# Altium schematic sheet STM32.SchDoc
size A4; DocumentNumber: 5; SheetNumber: 5; SheetTotal: 7
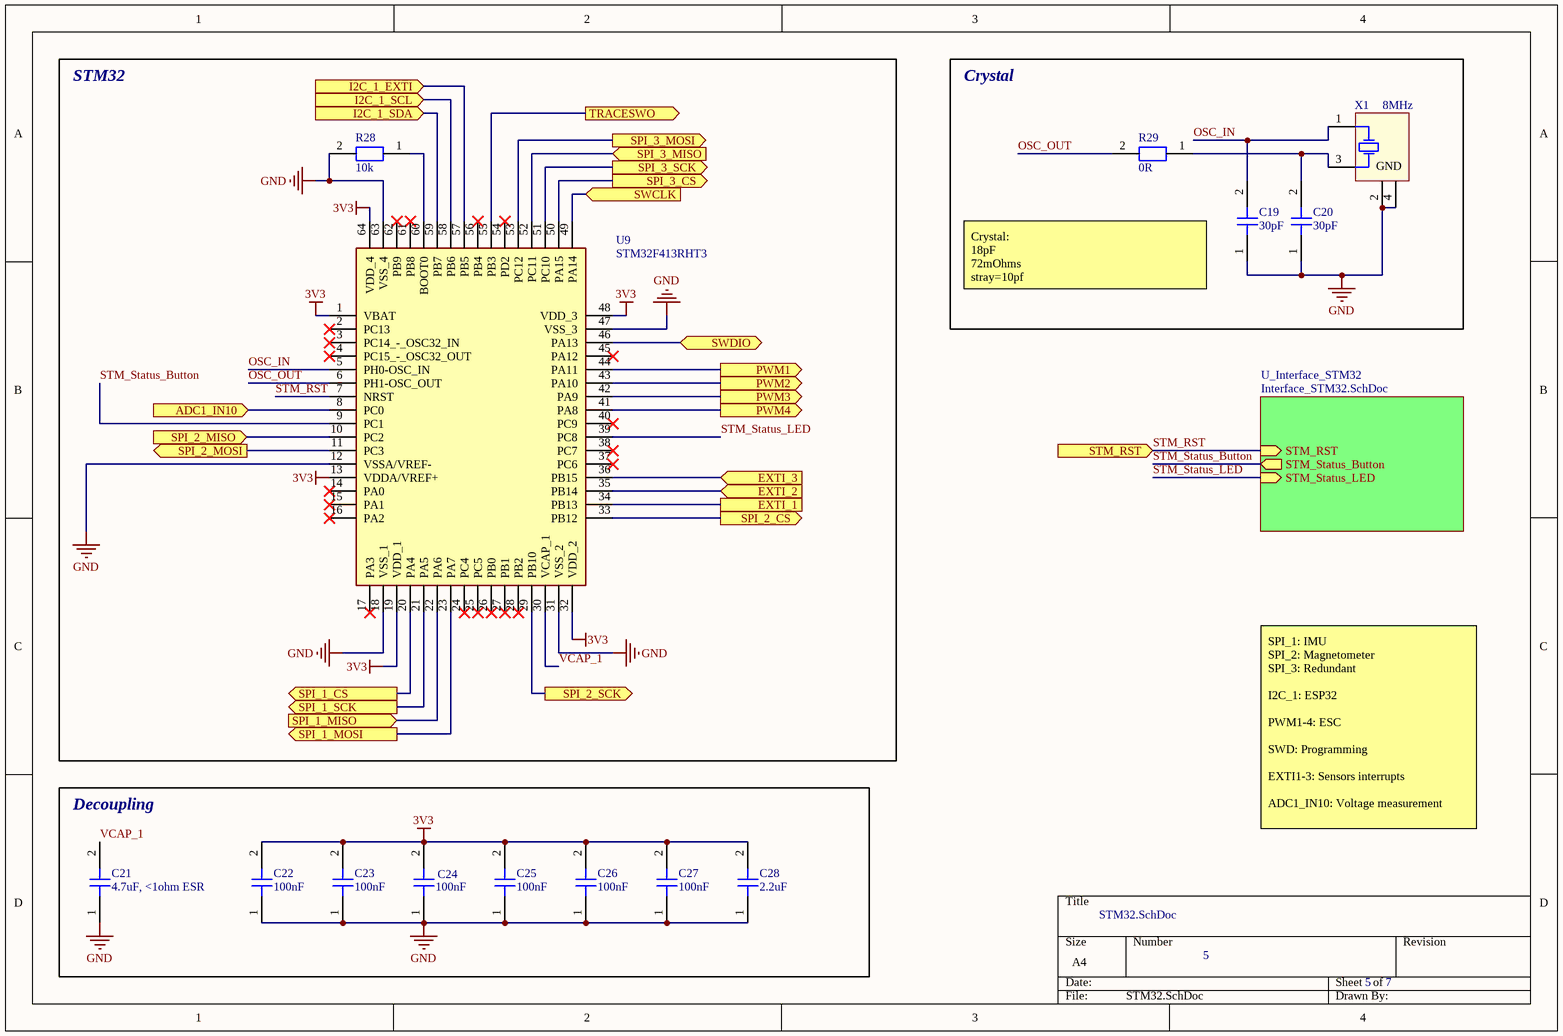
[diagram p0: STM32.SchDoc]

## Parts
C19  30pF  [Cap_0603_Medium_Density]
C20  30pF  [Cap_0603_Medium_Density]
C21  4.7uF, <1ohm ESR  [Cap_0603_Medium_Density]
C22  100nF  [Cap_0603_Medium_Density]
C23  100nF  [Cap_0603_Medium_Density]
C24  100nF  [Cap_0603_Medium_Density]
C25  100nF  [Cap_0603_Medium_Density]
C26  100nF  [Cap_0603_Medium_Density]
C27  100nF  [Cap_0603_Medium_Density]
C28  2.2uF  [Cap_0603_Medium_Density]
R28  10k  [Res_0603_Medium_Density]
R29  0R  [Res_0603_Medium_Density]
U9  STM32F413RHT3  [QFP50P1200X1200X160-64N]
X1  8MHz  [ABRA-ABMM2-4_V]

## Blocks framed on the sheet
STM32: R28 U9
Crystal: C19 C20 R29 X1
Decoupling: C21-C28

## Sub-sheets
U_Interface_STM32 = Interface_STM32.SchDoc: STM_Status_Button (out), STM_Status_LED (in), STM_RST (in)

## Ports
ADC1_IN10 (in), EXTI_1, EXTI_2 (in), EXTI_3 (in), I2C_1_EXTI (in), I2C_1_SCL (in), I2C_1_SDA (in), PWM1 (out), PWM2 (out), PWM3 (out), PWM4 (out), SPI_1_CS (out), SPI_1_MISO (in), SPI_1_MOSI (out), SPI_1_SCK (out), SPI_2_CS (out), SPI_2_MISO (in), SPI_2_MOSI (out), SPI_2_SCK (out), SPI_3_CS (out), SPI_3_MISO (in), SPI_3_MOSI (out), SPI_3_SCK (out), STM_RST (in), SWCLK (in), SWDIO (bidir), TRACESWO (out)

## Nets
3V3: C22.2 C23.2 C24.2 C25.2 C26.2 C27.2 C28.2 U9.1(VBAT) U9.13(VDDA/VREF+) U9.19(VDD_1) U9.32(VDD_2) U9.48(VDD_3) U9.64(VDD_4)
GND: C19.1 C20.1 C21.1 C22.1 C23.1 C24.1 C25.1 C26.1 C27.1 C28.1 R28.2 U9.12(VSSA/VREF-) U9.18(VSS_1) U9.31(VSS_2) U9.47(VSS_3) U9.63(VSS_4) X1.2(GND) X1.4(GND)
ADC1_IN10: U9.8(PC0) ; port ADC1_IN10
EXTI_1: U9.34(PB13) ; port EXTI_1
EXTI_2: U9.35(PB14) ; port EXTI_2
EXTI_3: U9.36(PB15) ; port EXTI_3
I2C_1_EXTI: U9.57(PB5) ; port I2C_1_EXTI
I2C_1_SCL: U9.58(PB6) ; port I2C_1_SCL
I2C_1_SDA: U9.59(PB7) ; port I2C_1_SDA
OSC_IN: C19.2 U9.5(PH0-OSC_IN) X1.1(X1)
OSC_OUT: R29.2 U9.6(PH1-OSC_OUT)
PWM1: U9.44(PA11) ; port PWM1
PWM2: U9.43(PA10) ; port PWM2
PWM3: U9.42(PA9) ; port PWM3
PWM4: U9.41(PA8) ; port PWM4
SPI_1_CS: U9.20(PA4) ; port SPI_1_CS
SPI_1_MISO: U9.22(PA6) ; port SPI_1_MISO
SPI_1_MOSI: U9.23(PA7) ; port SPI_1_MOSI
SPI_1_SCK: U9.21(PA5) ; port SPI_1_SCK
SPI_2_CS: U9.33(PB12) ; port SPI_2_CS
SPI_2_MISO: U9.10(PC2) ; port SPI_2_MISO
SPI_2_MOSI: U9.11(PC3) ; port SPI_2_MOSI
SPI_2_SCK: U9.29(PB10) ; port SPI_2_SCK
SPI_3_CS: U9.50(PA15) ; port SPI_3_CS
SPI_3_MISO: U9.52(PC11) ; port SPI_3_MISO
SPI_3_MOSI: U9.53(PC12) ; port SPI_3_MOSI
SPI_3_SCK: U9.51(PC10) ; port SPI_3_SCK
STM_RST: U9.7(NRST) ; port STM_RST, sheet U_Interface_STM32/STM_RST
STM_Status_Button: U9.9(PC1) ; sheet U_Interface_STM32/STM_Status_Button
STM_Status_LED: U9.39(PC8) ; sheet U_Interface_STM32/STM_Status_LED
SWCLK: U9.49(PA14) ; port SWCLK
SWDIO: U9.46(PA13) ; port SWDIO
TRACESWO: U9.55(PB3) ; port TRACESWO
VCAP_1: C21.2 U9.30(VCAP_1)
NetC20_2: C20.2 R29.1 X1.3(X2)
NetR28_1: R28.1 U9.60(BOOT0)

Not connected (* = marked no-connect by the designer): U9 2(PC13)* 3(PC14_-_OSC32_IN)* 4(PC15_-_OSC32_OUT)* 14(PA0)* 15(PA1)* 16(PA2)* 17(PA3)* 24(PC4)* 25(PC5)* 26(PB0)* 27(PB1)* 28(PB2)* 37(PC6)* 38(PC7)* 40(PC9)* 45(PA12)* 54(PD2)* 56(PB4)* 61(PB8)* 62(PB9)*

## Notes on the sheet
- (near C19) Crystal:
  18pF
  72mOhms
  stray=10pf
- SPI_1: IMU
  SPI_2: Magnetometer
  SPI_3: Redundant
  I2C_1: ESP32
  PWM1-4: ESC
  SWD: Programming
  EXTI1-3: Sensors interrupts
  ADC1_IN10: Voltage measurement

## Library data of the parts
C19 C20 = Capacitor_MLLC: Part Number: 06031A300FAT2A; Supplier: Mouser; ComponentLink1Description: Online Store Link; ComponentLink1URL: *; Manufacturer: *; Value: 30pF; Voltage: *; Package: 0603
C21 = Capacitor_MLLC: Part Number: 06035U4R7JAT2A; Supplier: Mouser; ComponentLink1Description: Online Store Link; ComponentLink1URL: *; Manufacturer: *; Value: 4.7uF; Voltage: *; Package: 0603
C22-C27 = Capacitor_MLLC: Part Number: CC0603KRX7R8BB104; Supplier: Mouser; ComponentLink1Description: Online Store Link; ComponentLink1URL: *; Manufacturer: *; Value: 100nF; Voltage: *; Package: 0603
C28 = Capacitor_MLLC: Part Number: 06036G225ZAT2A; Supplier: Mouser; ComponentLink1Description: Online Store Link; ComponentLink1URL: *; Manufacturer: *; Value: 2.2uF; Voltage: *; Package: 0603
R28 = Resistor_SMD: Part Number: CR0603AFX-1002EAS; Value: 10k; Manufacturer: *; Supplier: Mouser; Voltage: *; ComponentLink1Description: Online Store Link; ComponentLink1URL: *; Package: 0603
R29 = Resistor_SMD: Part Number: CR0603AJ/-000ELF; Value: 0R; Manufacturer: *; Supplier: Mouser; Voltage: *; ComponentLink1Description: Online Store Link; ComponentLink1URL: *; Package: 0603
U9 = STM32F413RHT3: Arm-Cortex-M4 32b MCU+FPU, 125 DMIPS, up to 1.5MB flash, 320KB RAM, USB OTG FS, 1 ADC, 2 DACs, 2 DFSDMs; Manufacturer_Name: STMicroelectronics; Geometry.Height: 1.6mm; Manufacturer_Part_Number: STM32F413RHT3; Mouser Part Number: 511-STM32F413RHT3; Mouser Price/Stock: https://www.mouser.co.uk/ProductDetail/STMicroelectronics/STM32F413RHT3?qs=FNcb6ahWXRwlxxHMGg5GHA%3D%3D; Datasheet Link: https://www.st.com/resource/en/datasheet/stm32f413cg.pdf; Part Number: STM32F413RHT3; Supplier: Mouser
X1 = CMP-0277-00003-1: Ceramic Surface Mount Low Profile Quartz Crystal, 8 MHz, -20 to 70 degC, 4-Pin 6 x 3.6 x 1.2 mm SMD, RoHS, 1000pcs / Reel; Manufacturer: Abracon; PartNumber: ABMM2-8.000MHZ-E2-T; ESR: 72 Ohm Max.; Shunt Capacitance C0: 7 pF Max.; Load Capacitance CL: 18 pF Typ.; ComponentLink3Description: Package Specification; PackageDescription: 4-Pin SMD, Body 6 x 3.6 mm, Pitch 4.4 mm; ComponentLink1URL: http://www.abracon.com/; Frequency: 8 MHz; ComponentLink2URL: http://www.abracon.com/Resonators/ABMM2.pdf; Temperature Range: -20 to 70 degC; Mounting Technology: Surface Mount; RoHS: TRUE; ComponentLink2Description: Datasheet; ComponentLink3URL: http://www.abracon.com/Resonators/ABMM2.pdf; ComponentLink1Description: Manufacturer URL; Packing: 1000pcs / Reel; Manufacturer_Name: Abracon; Part Number: ABMM2-8.000MHZ-E2-T; Supplier: Mouser